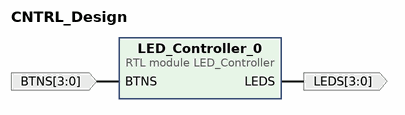
[diagram p0: block diagram of the top level]
# Vivado block design CNTRL_Design, xc7z020clg400-1, Vivado 2022.2
create_bd_design CNTRL_Design

create_bd_port -dir I -from 3 -to 0 BTNS
create_bd_port -dir O -from 3 -to 0 LEDS

create_bd_cell -type module -reference LED_Controller LED_Controller_0

# ---- connections ----

connect_bd_net [get_bd_ports BTNS] [get_bd_pins LED_Controller_0/BTNS]
connect_bd_net [get_bd_pins LED_Controller_0/LEDS] [get_bd_ports LEDS]

validate_bd_design
save_bd_design
